# Altium schematic sheet HYDRA_V3_NAV_CRIPPLED.SchDoc
size B; SheetNumber: 1; SheetTotal: 5
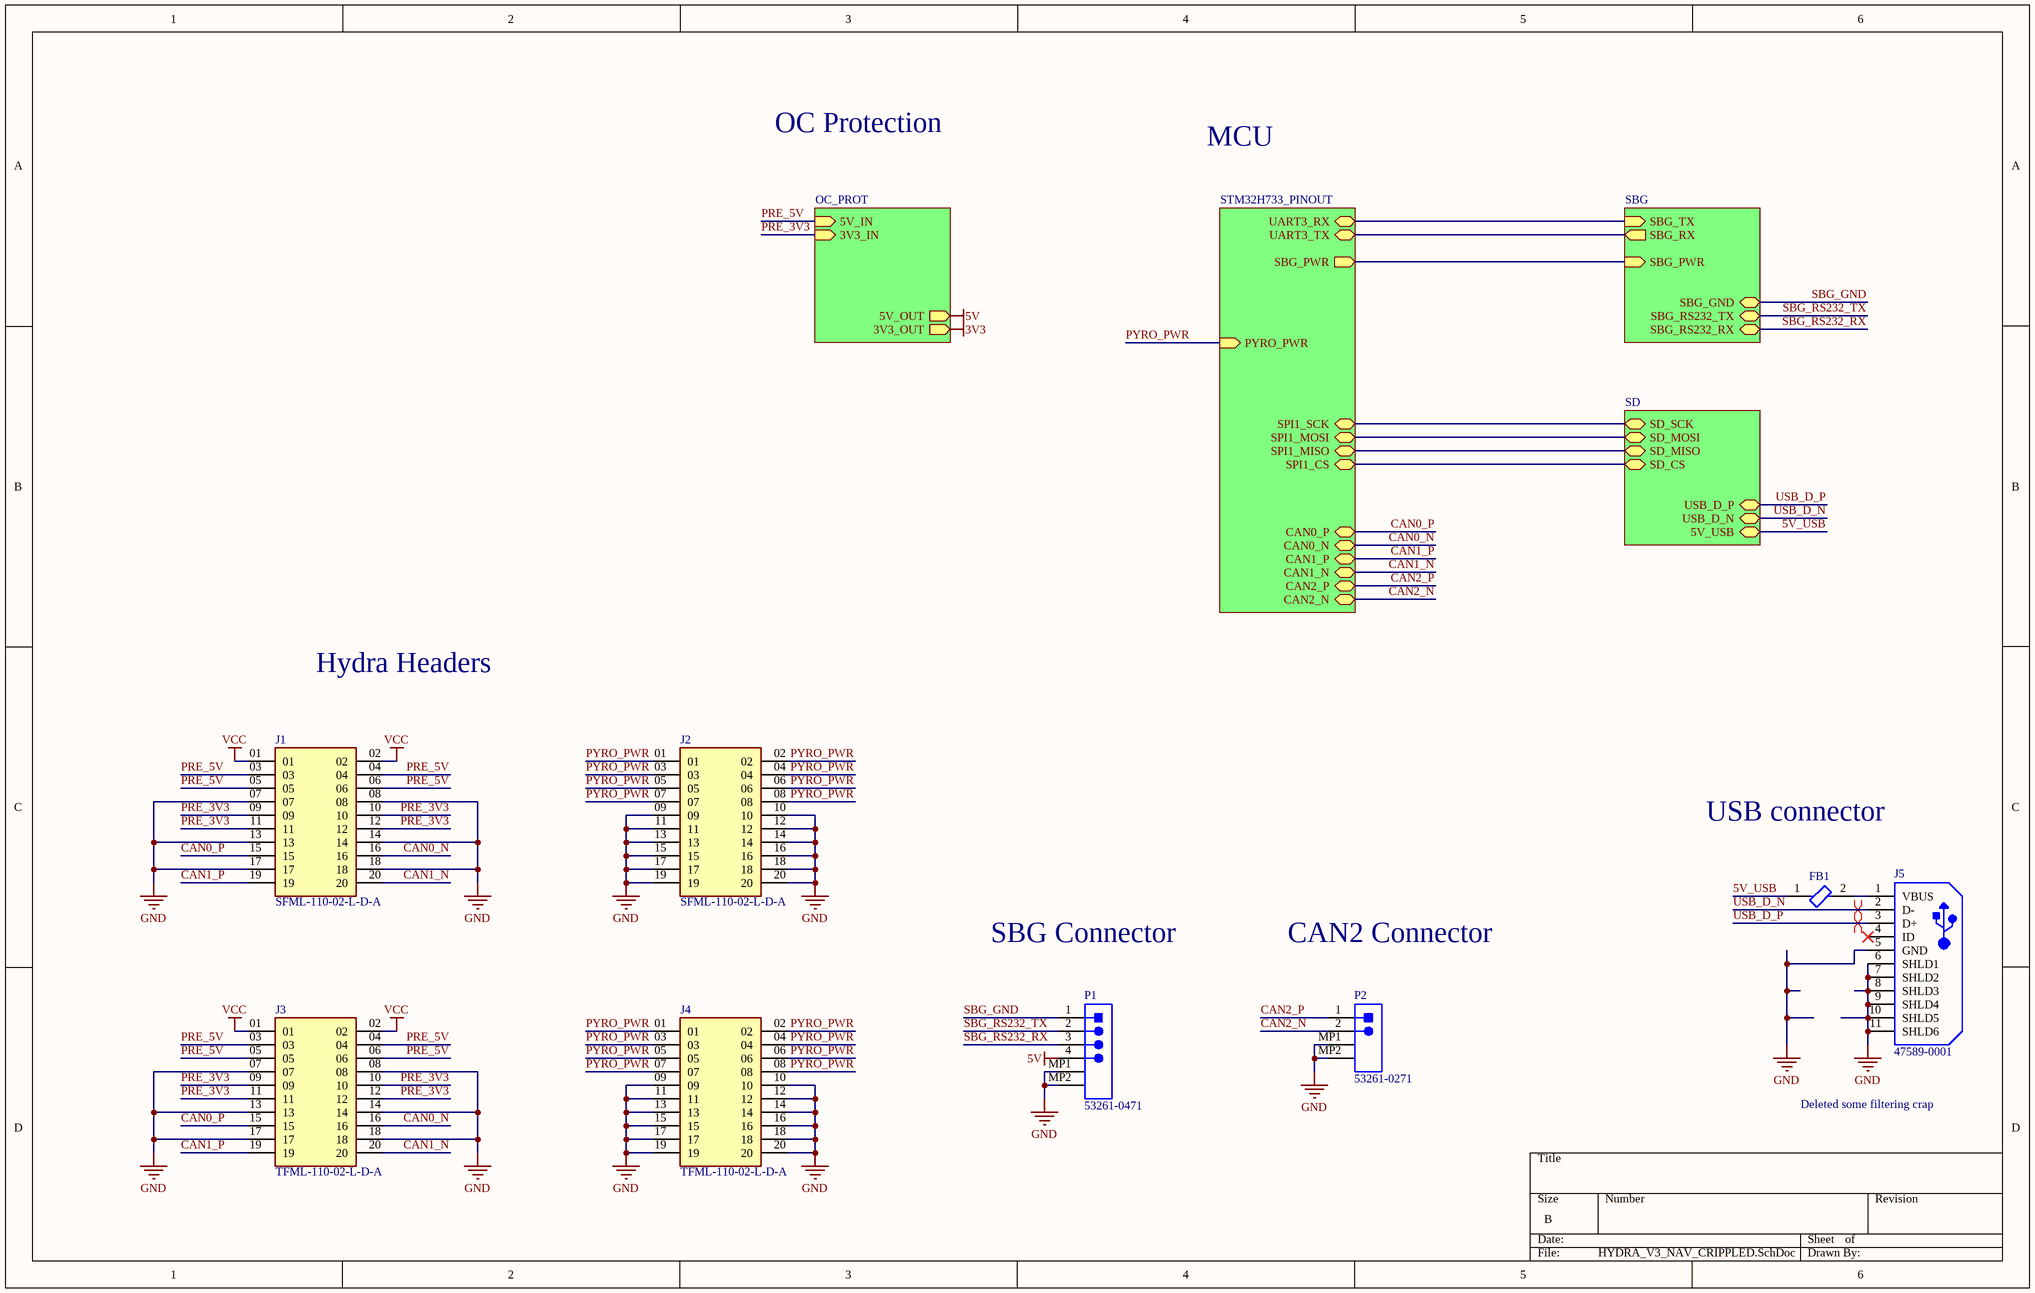
[diagram p0: HYDRA_V3_NAV_CRIPPLED.SchDoc]

## Parts
FB1  BLM18PG121SN1D  [FP-BLM18-0_15-t0_8-IPC_A]  (value not drawn)
J1  SFML-110-02-L-D-A  [SFML-110-02-L-D-A-Footprint-1]
J2  SFML-110-02-L-D-A  [SFML-110-02-L-D-A-Footprint-1]
J3  TFML-110-02-L-D-A  [TFML-110-02-L-D-A-Footprint-1]
J4  TFML-110-02-L-D-A  [TFML-110-02-L-D-A-Footprint-1]
J5  47589-0001  [MOLX-47589-0001_V]
P1  53261-0471  [MOLEX-53261-0471_V]
P2  53261-0271  [MOLX-53261-0271_V]

## Sub-sheets
OC_PROT = OC_PROT: 5V_OUT (out), 5V_IN (in), 3V3_IN (in), 3V3_OUT (out)
SBG = SBG: SBG_TX (in), SBG_RX (out), SBG_PWR (in), SBG_RS232_RX (bidir), SBG_RS232_TX (bidir), SBG_GND (bidir)
SD = SD: SD_SCK (bidir), SD_MOSI (bidir), SD_CS (bidir), SD_MISO (bidir), USB_D_P (bidir), USB_D_N (bidir), 5V_USB (bidir)
STM32H733_PINOUT = STM32H733_PINOUT: CAN0_P (bidir), CAN0_N (bidir), PYRO_PWR (in), CAN1_P (bidir), CAN1_N (bidir), CAN2_P (bidir), CAN2_N (bidir), SPI1_SCK (bidir), SPI1_MISO (bidir), SPI1_MOSI (bidir), SPI1_CS (bidir), UART3_RX (bidir), UART3_TX (bidir), SBG_PWR (out)

## Nets
3V3: sheet OC_PROT/3V3_OUT
5V: P1.4 ; sheet OC_PROT/5V_OUT
GND: J1.07 J1.08 J1.13 J1.14 J1.17 J1.18 J2.09 J2.10 J2.11 J2.12 J2.13 J2.14 J2.15 J2.16 J2.17 J2.18 J2.19 J2.20 J3.07 J3.08 J3.13 J3.14 J3.17 J3.18 J4.09 J4.10 J4.11 J4.12 J4.13 J4.14 J4.15 J4.16 J4.17 J4.18 J4.19 J4.20 J5.5(GND) J5.6(SHLD1) J5.7(SHLD2) J5.8(SHLD3) J5.9(SHLD4) J5.10(SHLD5) J5.11(SHLD6) P1.MP1 P1.MP2 P2.MP1 P2.MP2
VCC: J1.01 J1.02 J3.01 J3.02
5V_USB: FB1.1 ; sheet SD/5V_USB
CAN0_N: J1.16 J3.16 ; sheet STM32H733_PINOUT/CAN0_N
CAN0_P: J1.15 J3.15 ; sheet STM32H733_PINOUT/CAN0_P
CAN1_N: J1.20 J3.20 ; sheet STM32H733_PINOUT/CAN1_N
CAN1_P: J1.19 J3.19 ; sheet STM32H733_PINOUT/CAN1_P
CAN2_N: P2.2 ; sheet STM32H733_PINOUT/CAN2_N
CAN2_P: P2.1 ; sheet STM32H733_PINOUT/CAN2_P
PRE_3V3: J1.09 J1.10 J1.11 J1.12 J3.09 J3.10 J3.11 J3.12 ; sheet OC_PROT/3V3_IN
PRE_5V: J1.03 J1.04 J1.05 J1.06 J3.03 J3.04 J3.05 J3.06 ; sheet OC_PROT/5V_IN
PYRO_PWR: J2.01 J2.02 J2.03 J2.04 J2.05 J2.06 J2.07 J2.08 J4.01 J4.02 J4.03 J4.04 J4.05 J4.06 J4.07 J4.08 ; sheet STM32H733_PINOUT/PYRO_PWR
SBG_GND: P1.1 ; sheet SBG/SBG_GND
SBG_RS232_RX: P1.3 ; sheet SBG/SBG_RS232_RX
SBG_RS232_TX: P1.2 ; sheet SBG/SBG_RS232_TX
USB_D_N: J5.2(D-) ; sheet SD/USB_D_N
USB_D_P: J5.3(D+) ; sheet SD/USB_D_P
NetFB1_2: FB1.2 J5.1(VBUS)
(unnamed): sheet STM32H733_PINOUT/SPI1_SCK, sheet SD/SD_SCK
(unnamed): sheet STM32H733_PINOUT/SPI1_MISO, sheet SD/SD_MISO
(unnamed): sheet STM32H733_PINOUT/SPI1_MOSI, sheet SD/SD_MOSI
(unnamed): sheet STM32H733_PINOUT/SPI1_CS, sheet SD/SD_CS
(unnamed): sheet STM32H733_PINOUT/UART3_RX, sheet SBG/SBG_TX
(unnamed): sheet STM32H733_PINOUT/UART3_TX, sheet SBG/SBG_RX
(unnamed): sheet STM32H733_PINOUT/SBG_PWR, sheet SBG/SBG_PWR

Not connected (* = marked no-connect by the designer): J5 4(ID)*

## Layout directives
differential pair: USB_D_N, USB_D_P

## Notes on the sheet
- OC Protection
- MCU
- Hydra Headers
- USB connector
- SBG Connector
- CAN2 Connector
- Deleted some filtering crap

## Library data of the parts
FB1 = CMP-0686-00557-7: Chip Ferrite Bead, 0603, 120Ω @ 100MHz, 0.05Ω, 25%, 2A; Impedance: 120R; Number of Circuits: 1; Shielding: Unshielded; Material: Steel; DC Resistance (DCR): 50mR; Case Code (Imperial): 0603; RoHS Compliant: Yes; Number of Pins: 2; Min Operating Temperature: -55°C; Case Code (Metric): 1608; Frequency: 100MHz; Length: 1.6mm; Test Frequency: 100MHz; Max Operating Temperature: 125°C; Packaging: Tape and Reel; Max Current Rating: 2A; Termination: SMD/SMT; Lead Free: Lead Free; Max DC Current: 2A; Case/Package: 0603; Height: 0.8mm; Current Rating: 2A; Radiation Hardening: No; Core Material: Ferrite; DC Current: 2A; REACH SVHC: No SVHC; Package Quantity: 1; Depth: 0.8mm; Number of Lines: 1; Tolerance: 25%; Width: 0.8mm
J1 J2 = CMP-002-00076-2: Headers & Wire Housings .050 Tiger Eye High-Reliability Locking Socket Strip
J3 J4 = CMP-002-00077-1: Conn Shrouded Header (4 Sides) HDR 20 POS 1.27mm Solder ST Top Entry SMD TIGER EYE™ Tube
J5 = CMP-2000-05610-1: Right Angle Female Type AB Micro USB Connector, 30 V, 1.8 A, -30 to 85 degC, RoHS, Tape and Reel; Number of Ports: 1Port; Current Rating: 1.8A; Brand: Molex; Connector Type: MicroUSBTypeABreceptacle; Number of Contacts: 5Contact; Voltage Rating: 30VAC; Color: Black; Product: MicroUSBTypeABConnectors; Package URL: http://www.molex.com/pdm_docs/sd/475890001_sd.pdf; Contact Plating: Gold; Datasheet URL: http://www.molex.com/webdocs/datasheets/pdf/en-us/0475890001_IO_CONNECTORS.pdf; Operating Temperature Range: -20Cto+85C; Termination Style: SMD/SMT; Mounting Angle: Right; Package Reference: 47589-0001; Gender: Female; Package Description: Micro USB Connector, Pitch 0.65 mm, 5 Positions, Body 7.5 x 5.6 mm; Mounting Technology: SurfaceMount; Contact Material: CopperAlloy; Packaging: Reel; RoHS: True; Standard: USB; Manufacturer URL: http://www.molex.com/; Manufacturer: Molex; Datasheet Version: 12/2016; Product Category: USBConnectors; Series: 47589
P1 = CMP-2000-05238-1: Male Header, Pitch 1.25 mm, 1 x 4 Position, Height 3.4 mm, -40 to 85 degC, RoHS, Tape and Reel; Current Rating: 1A; Brand: Molex; Number of Positions / Contacts: 4; Pitch: 1.25mm; Voltage Rating: 125V; Mounting Angle: Right; Manufacturer URL: http://www.molex.com/; Factory Pack Quantity: 1000; Housing Material: Thermoplastic; Datasheet URL: http://www.molex.com/pdm_docs/sd/532610471_sd.pdf; Tradename: PicoBlade; Product Type: Headers; Contact Plating: Tin; Contact Material: PhosphorBronze; Package Description: 1.25mm Pitch PicoBlade(TM) Header, Surface Mount, Right Angle, Lead-Free, 4 Circuits; Mounting Style: SMD/SMT; Manufacturer: Molex; Series: 53261; Packaging: Reel; Number of Rows: 1; RoHS: Details; Number of Positions: 4; Product Category: Headers&WireHousings; Datasheet Version: Rev. G, 01/2012; Type: Shrouded; Termination Style: SMD
P2 = CMP-2000-05633-1: PicoBlade(TM) Header, Right Angle, -40 to 85 degC, 2-Pin SMD, RoHS, Tape and Reel; Current - Max: 1A; Brand: Molex; Voltage Rating: 125V; Number of Positions: 2; Pitch: 1.25mm; Package Version: Rev. H, 11/2014; Factory Pack Quantity: 1000; Datasheet URL: http://www.molex.com/webdocs/datasheets/pdf/en-us/0532610271_PCB_HEADERS.pdf; Datasheet Version: 03/2016; Housing Material: Thermoplastic; RoHS: Details; Product Type: Headers; Number of Rows: 1; Termination Style: SMD; Mounting Technology: SurfaceMount; Number of Positions / Contacts: 2; Package URL: http://www.molex.com/pdm_docs/sd/532610271_sd.pdf; Mounting Angle: Right; Mounting Style: SMD/SMT; Manufacturer: Molex; Product Category: 1.25mmConnectors; Tradename: PicoBlade; Voltage - Max: 125V; Manufacturer URL: http://www.molex.com/; Series: 53261; Package Description: 2-Leads Header, Pitch 1.25 mm, Mated Height 3.4 mm; Package Reference: 53261-0271; Current Rating: 1A; Contact Plating: Tin; Contact Material: PhosphorBronze; Type: Shrouded; Packaging: Reel